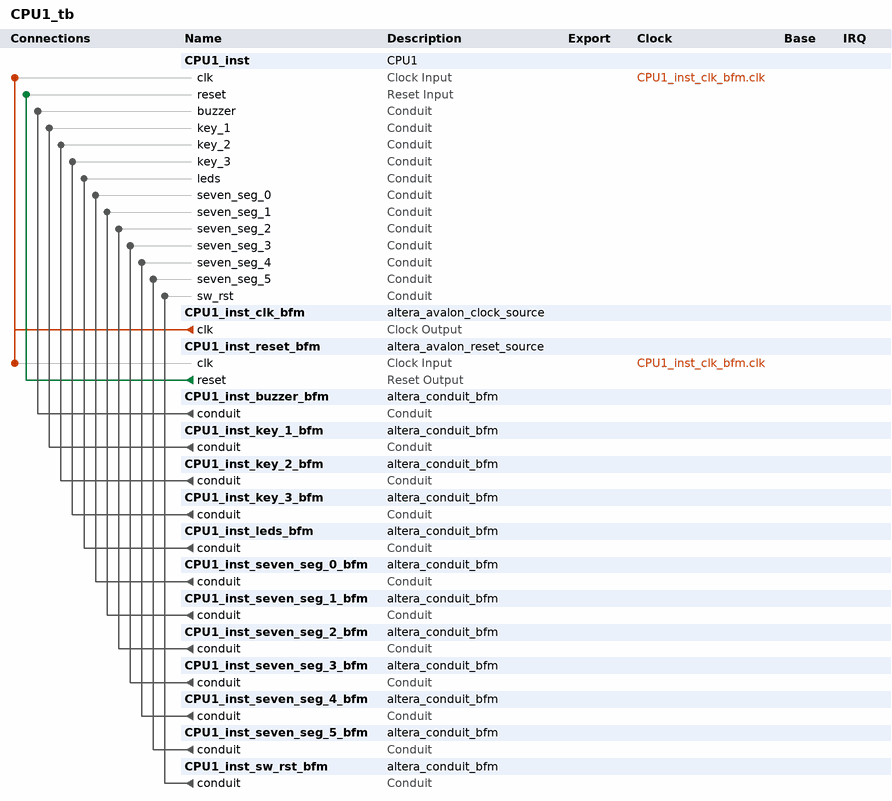
[diagram p0: system contents]
# Platform Designer (Qsys) system CPU1_tb, Cyclone V 5CSXFC6D6F31C6
# Parameters at their usual value, and those the tool derives, are not listed.
package require -exact qsys 18.1
create_system CPU1_tb
set_project_property DEVICE_FAMILY {Cyclone V}
set_project_property DEVICE 5CSXFC6D6F31C6

add_instance CPU1_inst CPU1 1.0

add_instance CPU1_inst_clk_bfm altera_avalon_clock_source 18.1

add_instance CPU1_inst_reset_bfm altera_avalon_reset_source 18.1
set_instance_parameter_value CPU1_inst_reset_bfm ASSERT_HIGH_RESET 0
set_instance_parameter_value CPU1_inst_reset_bfm INITIAL_RESET_CYCLES 50

add_instance CPU1_inst_buzzer_bfm altera_conduit_bfm 18.1
set_instance_parameter_value CPU1_inst_buzzer_bfm CLOCKED_SIGNAL false
set_instance_parameter_value CPU1_inst_buzzer_bfm ENABLE_RESET false
set_instance_parameter_value CPU1_inst_buzzer_bfm SIGNAL_DIRECTIONS input
set_instance_parameter_value CPU1_inst_buzzer_bfm SIGNAL_WIDTHS 1

add_instance CPU1_inst_key_1_bfm altera_conduit_bfm 18.1
set_instance_parameter_value CPU1_inst_key_1_bfm CLOCKED_SIGNAL false
set_instance_parameter_value CPU1_inst_key_1_bfm ENABLE_RESET false
set_instance_parameter_value CPU1_inst_key_1_bfm SIGNAL_DIRECTIONS output
set_instance_parameter_value CPU1_inst_key_1_bfm SIGNAL_WIDTHS 1

add_instance CPU1_inst_key_2_bfm altera_conduit_bfm 18.1
set_instance_parameter_value CPU1_inst_key_2_bfm CLOCKED_SIGNAL false
set_instance_parameter_value CPU1_inst_key_2_bfm ENABLE_RESET false
set_instance_parameter_value CPU1_inst_key_2_bfm SIGNAL_DIRECTIONS output
set_instance_parameter_value CPU1_inst_key_2_bfm SIGNAL_WIDTHS 1

add_instance CPU1_inst_key_3_bfm altera_conduit_bfm 18.1
set_instance_parameter_value CPU1_inst_key_3_bfm CLOCKED_SIGNAL false
set_instance_parameter_value CPU1_inst_key_3_bfm ENABLE_RESET false
set_instance_parameter_value CPU1_inst_key_3_bfm SIGNAL_DIRECTIONS output
set_instance_parameter_value CPU1_inst_key_3_bfm SIGNAL_WIDTHS 1

add_instance CPU1_inst_leds_bfm altera_conduit_bfm 18.1
set_instance_parameter_value CPU1_inst_leds_bfm CLOCKED_SIGNAL false
set_instance_parameter_value CPU1_inst_leds_bfm ENABLE_RESET false
set_instance_parameter_value CPU1_inst_leds_bfm SIGNAL_DIRECTIONS input
set_instance_parameter_value CPU1_inst_leds_bfm SIGNAL_WIDTHS 10

add_instance CPU1_inst_seven_seg_0_bfm altera_conduit_bfm 18.1
set_instance_parameter_value CPU1_inst_seven_seg_0_bfm CLOCKED_SIGNAL false
set_instance_parameter_value CPU1_inst_seven_seg_0_bfm ENABLE_RESET false
set_instance_parameter_value CPU1_inst_seven_seg_0_bfm SIGNAL_DIRECTIONS input
set_instance_parameter_value CPU1_inst_seven_seg_0_bfm SIGNAL_WIDTHS 7

add_instance CPU1_inst_seven_seg_1_bfm altera_conduit_bfm 18.1
set_instance_parameter_value CPU1_inst_seven_seg_1_bfm CLOCKED_SIGNAL false
set_instance_parameter_value CPU1_inst_seven_seg_1_bfm ENABLE_RESET false
set_instance_parameter_value CPU1_inst_seven_seg_1_bfm SIGNAL_DIRECTIONS input
set_instance_parameter_value CPU1_inst_seven_seg_1_bfm SIGNAL_WIDTHS 7

add_instance CPU1_inst_seven_seg_2_bfm altera_conduit_bfm 18.1
set_instance_parameter_value CPU1_inst_seven_seg_2_bfm CLOCKED_SIGNAL false
set_instance_parameter_value CPU1_inst_seven_seg_2_bfm ENABLE_RESET false
set_instance_parameter_value CPU1_inst_seven_seg_2_bfm SIGNAL_DIRECTIONS input
set_instance_parameter_value CPU1_inst_seven_seg_2_bfm SIGNAL_WIDTHS 7

add_instance CPU1_inst_seven_seg_3_bfm altera_conduit_bfm 18.1
set_instance_parameter_value CPU1_inst_seven_seg_3_bfm CLOCKED_SIGNAL false
set_instance_parameter_value CPU1_inst_seven_seg_3_bfm ENABLE_RESET false
set_instance_parameter_value CPU1_inst_seven_seg_3_bfm SIGNAL_DIRECTIONS input
set_instance_parameter_value CPU1_inst_seven_seg_3_bfm SIGNAL_WIDTHS 7

add_instance CPU1_inst_seven_seg_4_bfm altera_conduit_bfm 18.1
set_instance_parameter_value CPU1_inst_seven_seg_4_bfm CLOCKED_SIGNAL false
set_instance_parameter_value CPU1_inst_seven_seg_4_bfm ENABLE_RESET false
set_instance_parameter_value CPU1_inst_seven_seg_4_bfm SIGNAL_DIRECTIONS input
set_instance_parameter_value CPU1_inst_seven_seg_4_bfm SIGNAL_WIDTHS 7

add_instance CPU1_inst_seven_seg_5_bfm altera_conduit_bfm 18.1
set_instance_parameter_value CPU1_inst_seven_seg_5_bfm CLOCKED_SIGNAL false
set_instance_parameter_value CPU1_inst_seven_seg_5_bfm ENABLE_RESET false
set_instance_parameter_value CPU1_inst_seven_seg_5_bfm SIGNAL_DIRECTIONS input
set_instance_parameter_value CPU1_inst_seven_seg_5_bfm SIGNAL_WIDTHS 7

add_instance CPU1_inst_sw_rst_bfm altera_conduit_bfm 18.1
set_instance_parameter_value CPU1_inst_sw_rst_bfm CLOCKED_SIGNAL false
set_instance_parameter_value CPU1_inst_sw_rst_bfm ENABLE_RESET false
set_instance_parameter_value CPU1_inst_sw_rst_bfm SIGNAL_DIRECTIONS output
set_instance_parameter_value CPU1_inst_sw_rst_bfm SIGNAL_WIDTHS 1

# connections
add_connection CPU1_inst_clk_bfm.clk CPU1_inst.clk clock
add_connection CPU1_inst_clk_bfm.clk CPU1_inst_reset_bfm.clk clock
add_connection CPU1_inst_reset_bfm.reset CPU1_inst.reset reset
add_connection CPU1_inst_buzzer_bfm.conduit CPU1_inst.buzzer conduit
add_connection CPU1_inst_key_1_bfm.conduit CPU1_inst.key_1 conduit
add_connection CPU1_inst_key_2_bfm.conduit CPU1_inst.key_2 conduit
add_connection CPU1_inst_key_3_bfm.conduit CPU1_inst.key_3 conduit
add_connection CPU1_inst_leds_bfm.conduit CPU1_inst.leds conduit
add_connection CPU1_inst_seven_seg_0_bfm.conduit CPU1_inst.seven_seg_0 conduit
add_connection CPU1_inst_seven_seg_1_bfm.conduit CPU1_inst.seven_seg_1 conduit
add_connection CPU1_inst_seven_seg_2_bfm.conduit CPU1_inst.seven_seg_2 conduit
add_connection CPU1_inst_seven_seg_3_bfm.conduit CPU1_inst.seven_seg_3 conduit
add_connection CPU1_inst_seven_seg_4_bfm.conduit CPU1_inst.seven_seg_4 conduit
add_connection CPU1_inst_seven_seg_5_bfm.conduit CPU1_inst.seven_seg_5 conduit
add_connection CPU1_inst_sw_rst_bfm.conduit CPU1_inst.sw_rst conduit

set_interconnect_requirement {$system} qsys_mm.clockCrossingAdapter HANDSHAKE
set_interconnect_requirement {$system} qsys_mm.enableEccProtection FALSE
set_interconnect_requirement {$system} qsys_mm.insertDefaultSlave FALSE
set_interconnect_requirement {$system} qsys_mm.maxAdditionalLatency 1

save_system CPU1_tb.qsys
